# EAGLE schematic MAG3110 (EAGLE 6.2)
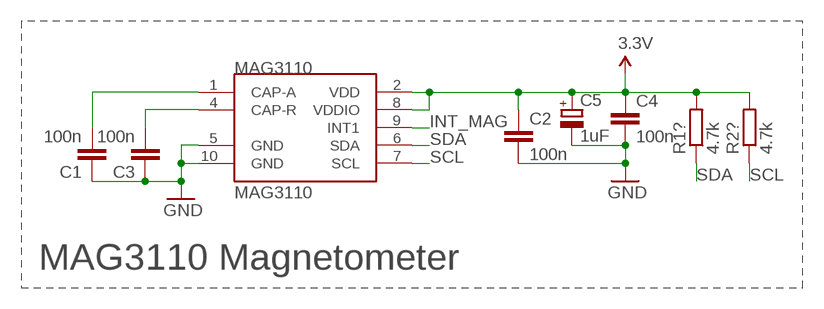
[diagram p0: schematic, sheet 1]

## Parts
C1  100n  C-EUC0805  [C0805]
C2  100n  C-EUC0805  [C0805]
C3  100n  C-EUC0805  [C0805]
C4  100n  C-EUC0805  [C0805]
C5  1uF  CPOL-EUSMCA  [SMC_A]
MAG3110  MAG3110  [DFN-10]
R1?  4.7k  R-EU_R0805  [R0805]
R2?  4.7k  R-EU_R0805  [R0805]

## Nets
3.3V: C2.1 C4.1 C5.+ MAG3110.2(VDD) MAG3110.8(VDDIO) R1?.2 R2?.2
GND: C1.1 C2.2 C3.1 C4.2 C5.- MAG3110.5(GND) MAG3110.10(GND)
INT_MAG: MAG3110.9(INT1)
N$2: C3.2 MAG3110.4(CAP-R)
N$3: C1.2 MAG3110.1(CAP-A)
SCL: MAG3110.7(SCL) R2?.1
SDA: MAG3110.6(SDA) R1?.1

## Notes on the sheet
- MAG3110 Magnetometer

## Library data of the parts
C1-C4 = rcl:C-EU: CAPACITOR, European symbol
C5 = rcl:CPOL-EU: POLARIZED CAPACITOR, European symbol
MAG3110 = sparkfun-sensors (2):MAG3110: 3-axis digital (I2C) magnetometer
R1? R2? = rcl:R-EU_: RESISTOR, European symbol